# EAGLE design ReleaseRev1 (EAGLE 7.1.0)
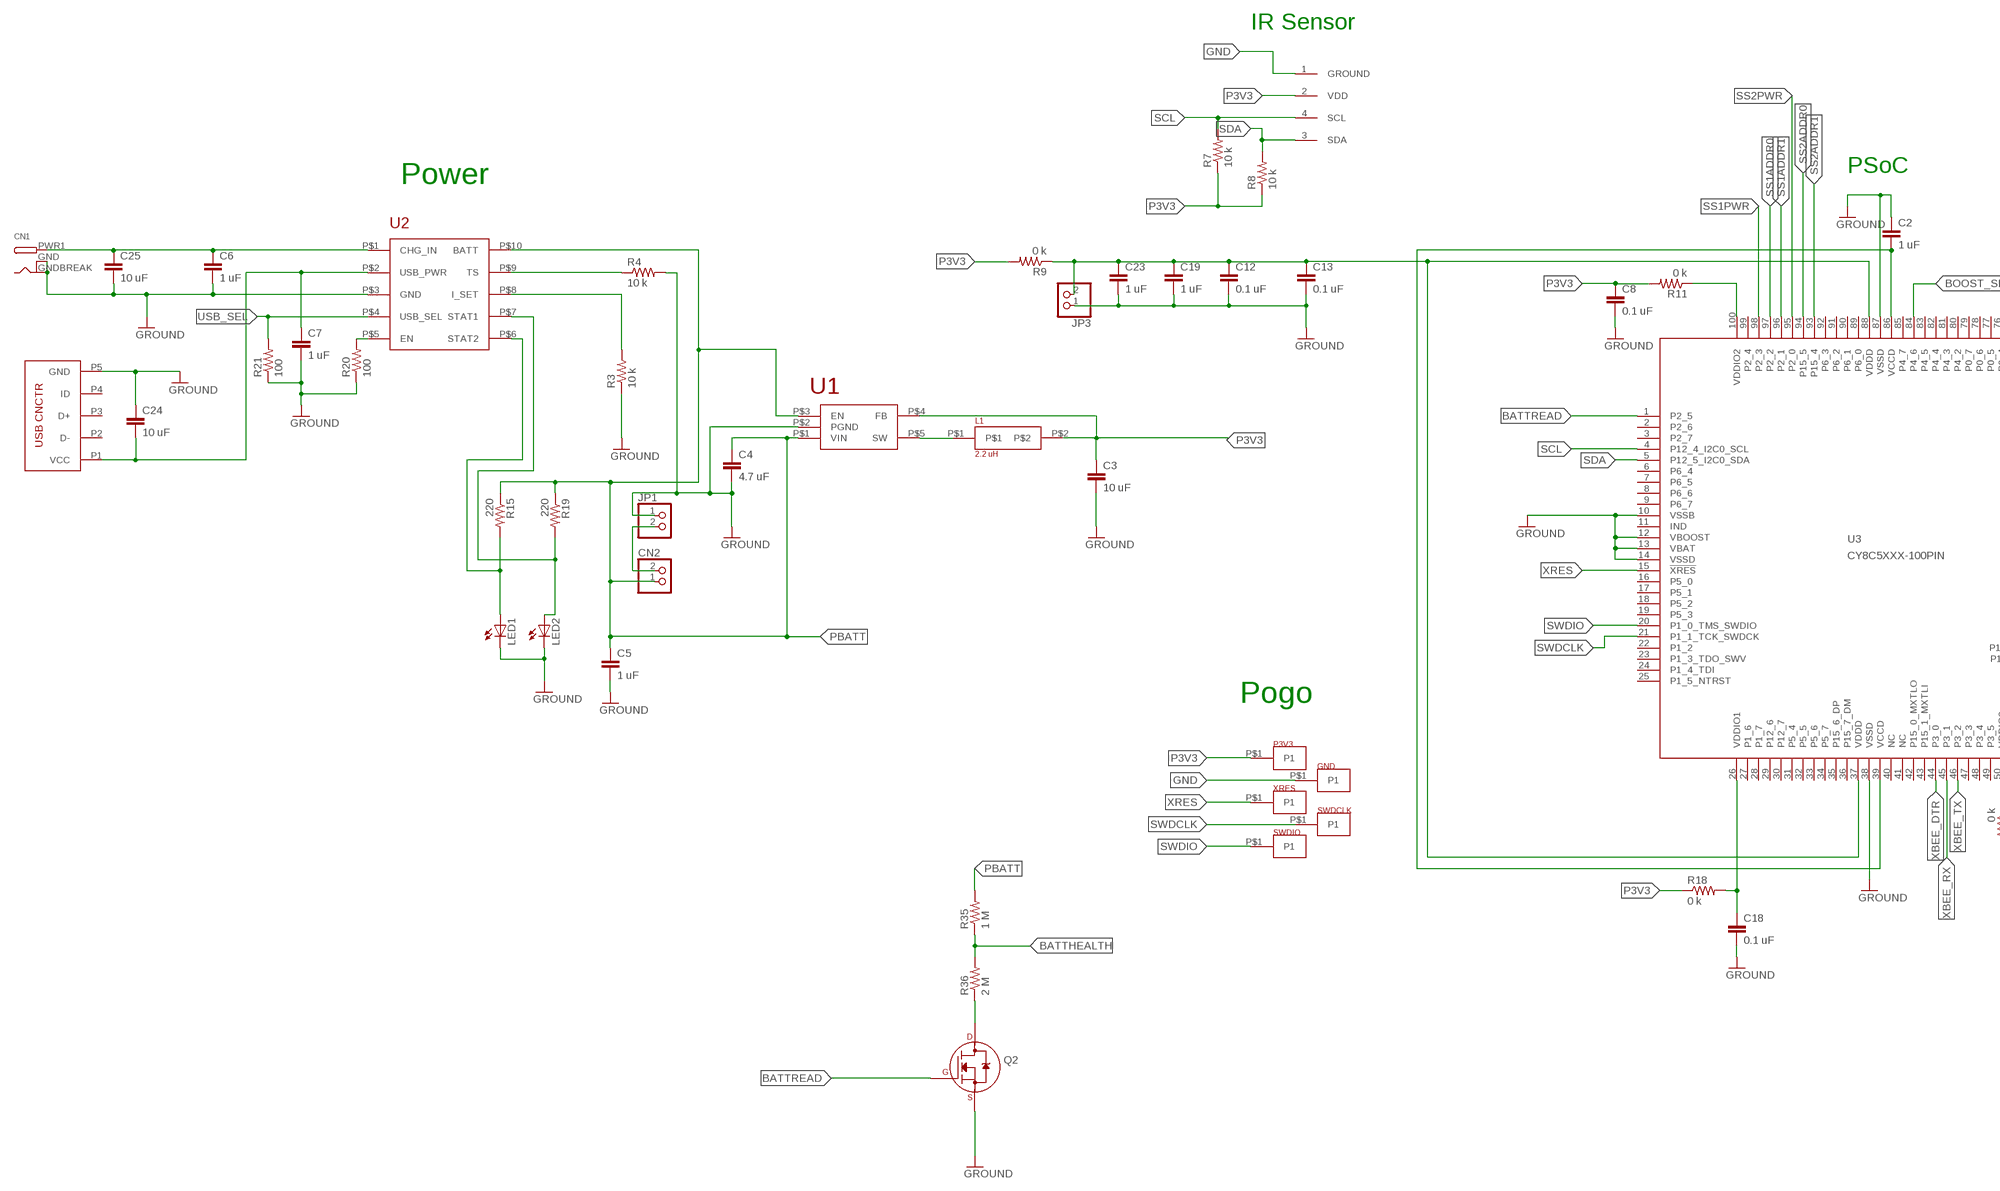
[diagram p0: schematic, sheet 1, part 1 of 2]
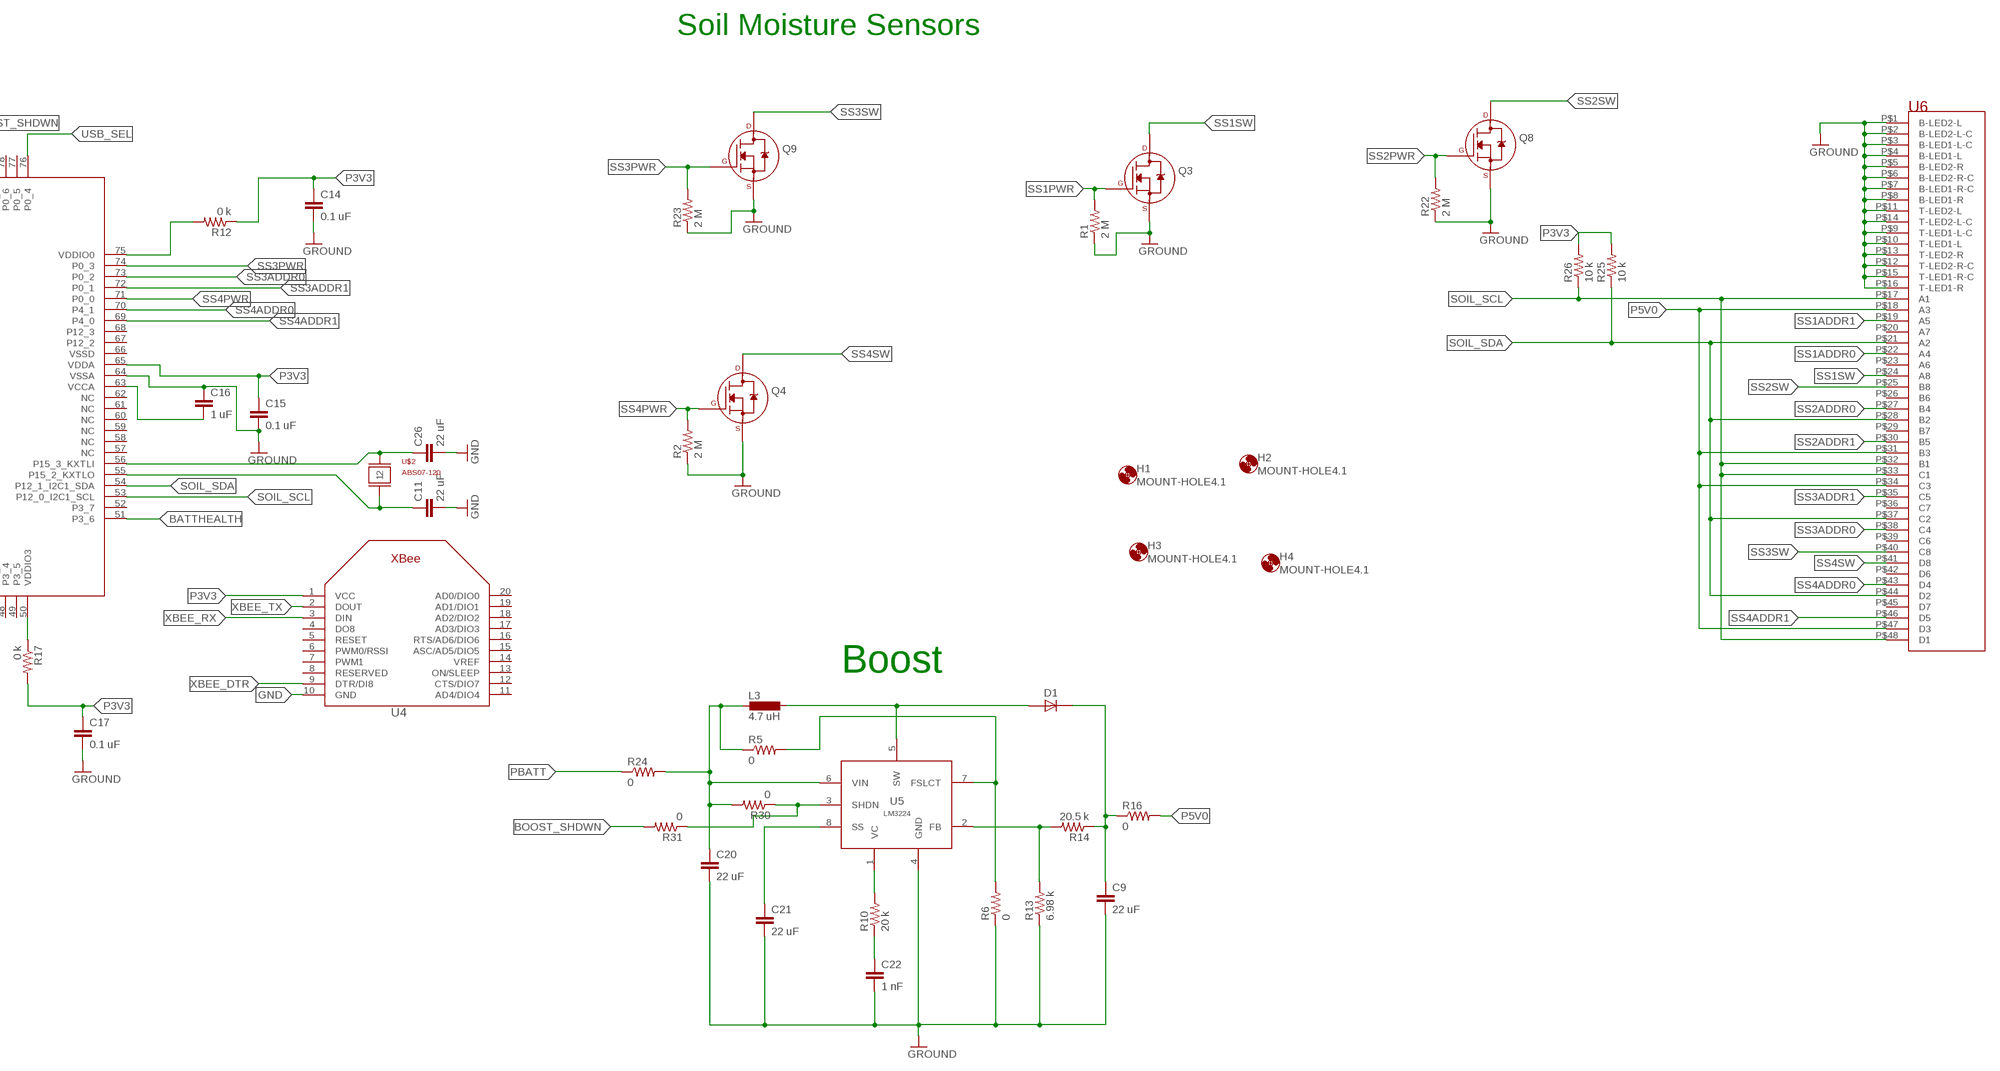
[diagram p1: schematic, sheet 1, part 2 of 2]

## Parts
C2  1 uF  CAPACITOR0603  [0603]
C3  10 uF  CAPACITOR0603  [0603]
C4  4.7 uF  CAPACITOR0603  [0603]
C5  1 uF  CAPACITOR0603  [0603]
C6  1 uF  CAPACITOR0603  [0603]
C7  1 uF  CAPACITOR0603  [0603]
C8  0.1 uF  CAPACITOR0603  [0603]
C9  22 uF  CAPACITOR0603  [0603]
C11  22 uF  CAPACITOR0603  [0603]
C12  0.1 uF  CAPACITOR0603  [0603]
C13  0.1 uF  CAPACITOR0603  [0603]
C14  0.1 uF  CAPACITOR0603  [0603]
C15  0.1 uF  CAPACITOR0603  [0603]
C16  1 uF  CAPACITOR0603  [0603]
C17  0.1 uF  CAPACITOR0603  [0603]
C18  0.1 uF  CAPACITOR0603  [0603]
C19  1 uF  CAPACITOR0603  [0603]
C20  22 uF  CAPACITOR0603  [0603]
C21  22 uF  CAPACITOR0603  [0603]
C22  1 nF  CAPACITOR0603  [0603]
C23  1 uF  CAPACITOR0603  [0603]
C24  10 uF  CAPACITOR0603  [0603]
C25  10 uF  CAPACITOR0603  [0603]
C26  22 uF  CAPACITOR0603  [0603]
CN1  DCBARRELSMT  [DCJACK_2MM_SMT]
CN2  JST_2PIN-SMT-RA  [JST-PH-2-SMT-RA]
D1  DIODE  [0603-LED]
GND  POGO-MOUNTING  [POGO-MOUNTING]
H1  MOUNT-HOLE4.1  [4,1]
H2  MOUNT-HOLE4.1  [4,1]
H3  MOUNT-HOLE4.1  [4,1]
H4  MOUNT-HOLE4.1  [4,1]
IRSENSOR  TO39  [TO39]
JP1  PINHD-1X2  [1X02]
JP3  PINHD-1X2  [1X02]
L1  LPO3310  [LPO3310]
L3  4.7 uH  DO3316P  [DO3316P]
LED1  LEDCHIP-LED0603  [CHIP-LED0603]
LED2  LEDCHIP-LED0603  [CHIP-LED0603]
P3V3  POGO-MOUNTING  [POGO-MOUNTING]
Q2  2N7000_SOT23  [SOT-23]
Q3  2N7000_SOT23  [SOT-23]
Q4  2N7000_SOT23  [SOT-23]
Q8  2N7000_SOT23  [SOT-23]
Q9  2N7000_SOT23  [SOT-23]
R1  2 M  RESISTOR0603  [0603]
R2  2 M  RESISTOR0603  [0603]
R3  10 k  RESISTOR0603  [0603]
R4  10 k  RESISTOR0603  [0603]
R5  0  RESISTOR0603  [0603]
R6  0  RESISTOR0603  [0603]
R7  10 k  RESISTOR0603  [0603]
R8  10 k  RESISTOR0603  [0603]
R9  0 k  RESISTOR0603  [0603]
R10  20 k  RESISTOR0603  [0603]
R11  0 k  RESISTOR0603  [0603]
R12  0 k  RESISTOR0603  [0603]
R13  6.98 k  RESISTOR0603  [0603]
R14  20.5 k  RESISTOR0603  [0603]
R15  220  RESISTOR0603  [0603]
R16  0  R-US_R2010  [R2010]
R17  0 k  RESISTOR0603  [0603]
R18  0 k  RESISTOR0603  [0603]
R19  220  RESISTOR0603  [0603]
R20  100  RESISTOR0603  [0603]
R21  100  RESISTOR0603  [0603]
R22  2 M  RESISTOR0603  [0603]
R23  2 M  RESISTOR0603  [0603]
R24  0  R-US_R2010  [R2010]
R25  10 k  RESISTOR0603  [0603]
R26  10 k  RESISTOR0603  [0603]
R30  0  RESISTOR0603  [0603]
R31  0  RESISTOR0603  [0603]
R35  1 M  RESISTOR0603  [0603]
R36  2 M  RESISTOR0603  [0603]
SWDCLK  POGO-MOUNTING  [POGO-MOUNTING]
SWDIO  POGO-MOUNTING  [POGO-MOUNTING]
U1  LM3671-407564  [LM3671-407564]
U2  LM3658  [LM3658]
U3  CY8C5XXX-100PIN  [TQFP-14X14-100]
U4  XBEE  [XBEE]
U5  LM3224  [MSOP-8]
U6  RJSAE-5380-04  [RJSAE-5380-04]
U$1  FCI10118192-0001LF  [FCI10118192-0001LF]
U$2  ABS07-120  [2-SMD]
XRES  POGO-MOUNTING  [POGO-MOUNTING]

## Nets
BATTHEALTH: R35.1 R36.2 U3.51(P3_6)
BATTREAD: Q2.1(G) U3.1(P2_5)
BOOST_SHDWN: R31.2 U3.84(P4_6)
GND: C2.1 C3.2 C4.2 C5.2 C6.2 C7.2 C8.2 C9.2 C11.2 C12.2 C13.2 C14.2 C15.2 C16.1 C17.2 C18.2 C19.2 C20.2 C21.2 C22.2 C23.2 C24.1 C25.2 C26.2 CN1.GND(GNDBREAK) CN1.GNDBREAK(GND) GND.P$1(P1) IRSENSOR.1(GROUND) JP1.1 JP3.1 LED1.C LED2.C Q2.2(S) Q3.2(S) Q4.2(S) Q8.2(S) Q9.2(S) R1.1 R2.1 R3.1 R4.2 R6.1 R13.1 R20.1 R21.1 R22.1 R23.1 U1.P$2(PGND) U2.P$3(GND) U3.10(VSSB) U3.12(VBOOST) U3.13(VBAT) U3.14(VSSD) U3.38(VSSD) U3.64(VSSA) U3.87(VSSD) U4.10(GND) U5.4(GND) U6.P$1(B-LED2-L) U6.P$2(B-LED2-L-C) U6.P$3(B-LED1-L-C) U6.P$4(B-LED1-L) U6.P$5(B-LED2-R) U6.P$6(B-LED2-R-C) U6.P$7(B-LED1-R-C) U6.P$8(B-LED1-R) U6.P$9(T-LED1-L-C) U6.P$10(T-LED1-L) U6.P$11(T-LED2-L) U6.P$12(T-LED2-R-C) U6.P$13(T-LED2-R) U6.P$14(T-LED2-L-C) U6.P$15(T-LED1-R-C) U6.P$16(T-LED1-R) U$1.P5(GND) ; supply symbol labelled GROUND
N$1: R20.2 U2.P$5(EN)
N$2: R3.2 U2.P$8(I_SET)
N$3: C21.1 U5.8(SS)
N$4: C26.1 U3.56(P15_3_KXTLI) U$2.1
N$5: C6.1 C25.1 CN1.PWR1(PWR) U2.P$1(CHG_IN)
N$6: C18.1 R18.2 U3.26(VDDIO1)
N$7: D1.A L3.2 U5.5(SW)
N$8: R4.1 U2.P$9(TS)
N$9: R10.2 U5.1(VC)
N$10: CN2.2 JP1.2
N$11: C22.1 R10.1
N$12: R13.2 R14.2 U5.2(FB)
N$13: C2.2 U3.39(VCCD) U3.86(VCCD)
N$14: Q2.3(D) R36.1
N$15: C16.2 U3.63(VCCA)
N$16: R5.2 R6.2 U5.7(FSLCT)
N$17: C11.1 U3.55(P15_2_KXTLO) U$2.2
N$18: R12.2 U3.75(VDDIO0)
N$19: R11.1 U3.100(VDDIO2)
N$21: C12.1 C13.1 C19.1 C23.1 JP3.2 R9.1 U3.37(VDDD) U3.88(VDDD)
N$22: R17.1 U3.50(VDDIO3)
N$25: LED2.A R19.2 U2.P$7(STAT1)
N$26: LED1.A R15.2 U2.P$6(STAT2)
N$28: L1.P$1 U1.P$5(SW)
N$47: R30.1 R31.1 U5.3(SHDN)
P: C20.1 L3.1 R5.1 R24.2 R30.2 U5.6(VIN)
P3V3: C3.1 C8.1 C14.1 C15.1 C17.1 IRSENSOR.2(VDD) L1.P$2 P3V3.P$1(P1) R7.1 R8.1 R9.2 R11.2 R12.1 R17.2 R18.1 R25.2 R26.2 U1.P$4(FB) U3.65(VDDA) U4.1(VCC)
P5: C9.1 D1.C R14.1 R16.1
P5V0: R16.2 U6.P$18(A3) U6.P$31(B3) U6.P$34(C3) U6.P$47(D3)
PBATT: C4.1 C5.1 CN2.1 R15.1 R19.1 R24.1 R35.2 U1.P$1(VIN) U1.P$3(EN) U2.P$10(BATT)
SCL: IRSENSOR.4(SCL) R7.2 U3.4(P12_4_I2C0_SCL)
SDA: IRSENSOR.3(SDA) R8.2 U3.5(P12_5_I2C0_SDA)
SOIL_SCL: R26.1 U3.53(P12_0_I2C1_SCL) U6.P$17(A1) U6.P$32(B1) U6.P$33(C1) U6.P$48(D1)
SOIL_SDA: R25.1 U3.54(P12_1_I2C1_SDA) U6.P$21(A2) U6.P$28(B2) U6.P$37(C2) U6.P$44(D2)
SS1ADDR0: U3.97(P2_2) U6.P$22(A4)
SS1ADDR1: U3.96(P2_1) U6.P$19(A5)
SS1PWR: Q3.1(G) R1.2 U3.98(P2_3)
SS1SW: Q3.3(D) U6.P$24(A8)
SS2ADDR0: U3.94(P15_5) U6.P$27(B4)
SS2ADDR1: U3.93(P15_4) U6.P$30(B5)
SS2PWR: Q8.1(G) R22.2 U3.95(P2_0)
SS2SW: Q8.3(D) U6.P$25(B8)
SS3ADDR0: U3.73(P0_2) U6.P$38(C4)
SS3ADDR1: U3.72(P0_1) U6.P$35(C5)
SS3PWR: Q9.1(G) R23.2 U3.74(P0_3)
SS3SW: Q9.3(D) U6.P$40(C8)
SS4ADDR0: U3.70(P4_1) U6.P$43(D4)
SS4ADDR1: U3.69(P4_0) U6.P$46(D5)
SS4PWR: Q4.1(G) R2.2 U3.71(P0_0)
SS4SW: Q4.3(D) U6.P$41(D8)
SWDCLK: SWDCLK.P$1(P1) U3.21(P1_1_TCK_SWDCK)
SWDIO: SWDIO.P$1(P1) U3.20(P1_0_TMS_SWDIO)
USB: C7.1 C24.2 U2.P$2(USB_PWR) U$1.P1(VCC)
USB_SEL: R21.2 U2.P$4(USB_SEL) U3.76(P0_4)
XBEE_DTR: U3.44(P3_0) U4.9(DTR/DI8)
XBEE_RX: U3.45(P3_1) U4.3(DIN)
XBEE_TX: U3.46(P3_2) U4.2(DOUT)
XRES: U3.15(!XRES!) XRES.P$1(P1)
Unconnected: U3.2(P2_6) U3.3(P2_7) U3.6(P6_4) U3.7(P6_5) U3.8(P6_6) U3.9(P6_7) U3.11(IND) U3.16(P5_0) U3.17(P5_1) U3.18(P5_2) U3.19(P5_3) U3.22(P1_2) U3.23(P1_3_TDO_SWV) U3.24(P1_4_TDI) U3.25(P1_5_NTRST) U3.27(P1_6) U3.28(P1_7) U3.29(P12_6) U3.30(P12_7) U3.31(P5_4) U3.32(P5_5) U3.33(P5_6) U3.34(P5_7) U3.35(P15_6_DP) U3.36(P15_7_DM) U3.40(NC) U3.41(NC) U3.42(P15_0_MXTLO) U3.43(P15_1_MXTLI) U3.47(P3_3) U3.48(P3_4) U3.49(P3_5) U3.52(P3_7) U3.57(NC) U3.58(NC) U3.59(NC) U3.60(NC) U3.61(NC) U3.62(NC) U3.66(VSSD) U3.67(P12_2) U3.68(P12_3) U3.77(P0_5) U3.78(P0_6) U3.79(P0_7) U3.80(P4_2) U3.81(P4_3) U3.82(P4_4) U3.83(P4_5) U3.85(P4_7) U3.89(P6_0) U3.90(P6_1) U3.91(P6_2) U3.92(P6_3) U3.99(P2_4) U4.4(DO8) U4.5(RESET) U4.6(PWM0/RSSI) U4.7(PWM1) U4.8(RESERVED) U4.11(AD4/DIO4) U4.12(CTS/DIO7) U4.13(ON/SLEEP) U4.14(VREF) U4.15(ASC/AD5/DIO5) U4.16(RTS/AD6/DIO6) U4.17(AD3/DIO3) U4.18(AD2/DIO2) U4.19(AD1/DIO1) U4.20(AD0/DIO0) U6.P$20(A7) U6.P$23(A6) U6.P$26(B6) U6.P$29(B7) U6.P$36(C7) U6.P$39(C6) U6.P$42(D6) U6.P$45(D7) U$1.P2(D-) U$1.P3(D+) U$1.P4(ID)

## Notes on the sheet
- IR Sensor
- PSoC
- Power
- Soil Moisture Sensors
- Pogo
- Boost

## Library data of the parts
C2-C9 C11-C26 = LAB1_BREAKOUT:CAPACITOR: Generic Capacitor
CN1 = adafruit:DCBARREL: 2.0mm DC Barrel Jack DCJACK_2MM_PTH - Through Hole Jack (4UConnector: 05537)
CN2 = adafruit:JST_2PIN: JST 2-Pin Connectors of various flavors SMT-RA (S2B-PH-SM4) 4UConnector #17311 SMT (B2B-PH-SM4) THM-RA (S2B-PH) THM (B2B-PH)
D1 = Alpha (3):DIODE
GND P3V3 SWDCLK SWDIO XRES = FinalRev:POGO-MOUNTING
H1-H4 = holes:MOUNT-HOLE: MOUNTING HOLE with drill center marker
IRSENSOR = mlx:TO39
JP1 JP3 = pinhead:PINHD-1X2: PIN HEADER
L1 = 136PWR:LPO3310: Coilcraft LPO3310 2.2 uH power inductor 150 mOhms
L3 = inductor-coilcraft:DO3316P: COILCRAFT; OC_FARNELL: unknown; OC_NEWARK: unknown
LED1 LED2 = adafruit:LED: LED OSRAM: - CHIPLED LG R971, LG N971, LY N971, LG Q971, LY Q971, LO R971, LY R971 LH N974, LH R974 LS Q976, LO Q976, LY Q976 LO Q996 - Hyper CHIPLED LW Q18S LB Q993, LB Q99A, LB R99A - SideLED LS A670, LO A670, LY A670, LG A670, LP A670 LB A673, LV A673, LT A673, LW A673 LH A674 LY A675 LS A676, LA A676, LO A676, LY A676, LW A676 LS A679, LY A679, LG A679 - Hyper Micro SIDELED® LS Y876, LA Y876, LO Y876, LY Y876 LT Y87S - SmartLED LW L88C, LW L88S LB L89C, LB L89S, LG L890 LS L89K, LO L89K, LY L89K LS L896, LA L896, LO L896, LY L896 - TOPLED LS T670, LO T670, LY T670, LG T670, LP T670 LSG T670, LSP T670, LSY T670, LOP T670, LYG T670 LG T671, LOG T671, LSG T671 LB T673, LV T673, LT T673, LW T673 LH T674 LS T676, LA T676, LO T676, LY T676, LB T676, LH T676, LSB T676, LW T676 LB T67C, LV T67C, LT T67C, LS T67K, LO T67K, LY T67K, LW E67C LS E67B, LA E67B, LO E67B, LY E67B, LB E67C, LV E67C, LT E67C LW T67C LS T679, LY T679, LG T679 LS T770, LO T770, LY T770, LG T770, LP T770 LB T773, LV T773, LT T773, LW T773 LH T774 LS E675, LA E675, LY E675, LS T675 LS T776, LA T776, LO T776, LY T776, LB T776 LHGB T686 LT T68C, LB T68C - Hyper Mini TOPLED® LB M676 - Mini TOPLED Santana® LG M470 LS M47K, LO M47K, LY M47K Source: http://www.osram.convergy.de/
Q2-Q4 Q8 Q9 = transistors:2N700*: 2N7000, 2N7002, NDS7002A N-channel enhancement mode MOSFET
R1-R15 R17-R23 R25 R26 R30 R31 R35 R36 = LAB1_BREAKOUT:RESISTOR: Generic Resistor
R16 R24 = adafruit:R-US_: RESISTOR, American symbol
U1 = 136PWR:LM3671-407564: DC DC voltage regulator
U2 = LM3658:LM3658
U3 = cypress_psoc_V2_0:CY8C5XXX-100PIN: Cypress PSoC® 5 - Programmable System on Chip, ARM Cortex-M3 Based Source Data: http://www.cypress.com/?mpn=CY8C5588AXI-060 LBR Source: http://www.westmarkelectronics.com Thomas W. Moxon Director of Engineering www.westmarkelectronics.com; MPN: CY8C5588AXI-060
U4 = Alpha (3):XBEE
U5 = Alpha (3):LM3224
U6 = FinalRev:RJSAE-5380-04
U$1 = USB_Connectors_5P_Micro_USB:FCI10118192-0001LF
U$2 = ABS07-120:ABS07-120

## Board
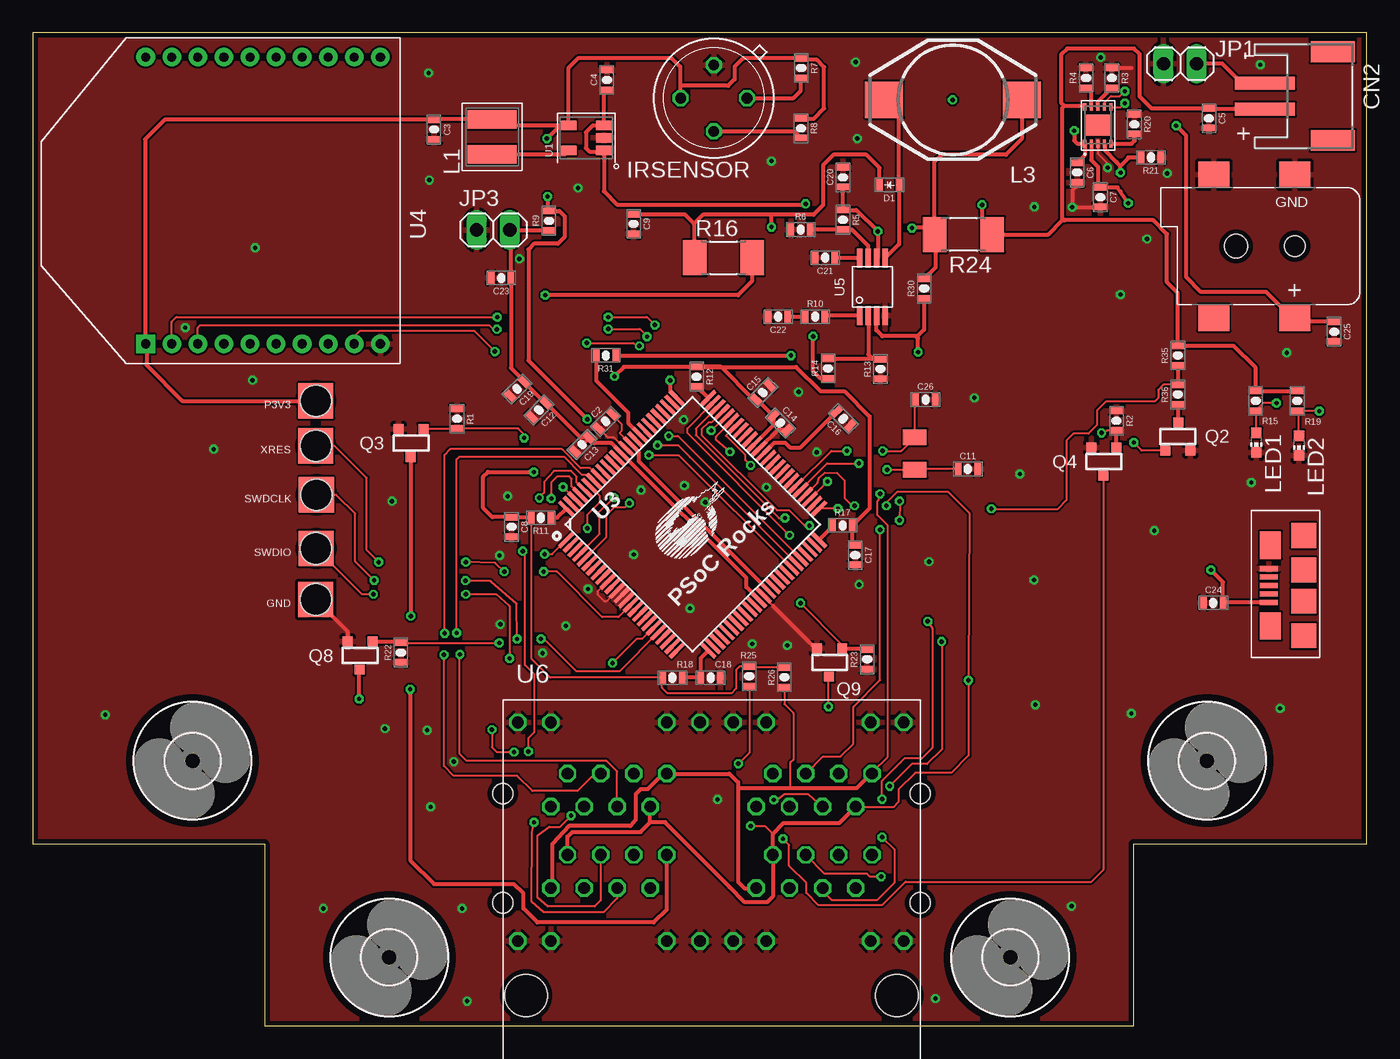
[diagram p2: board, top side]
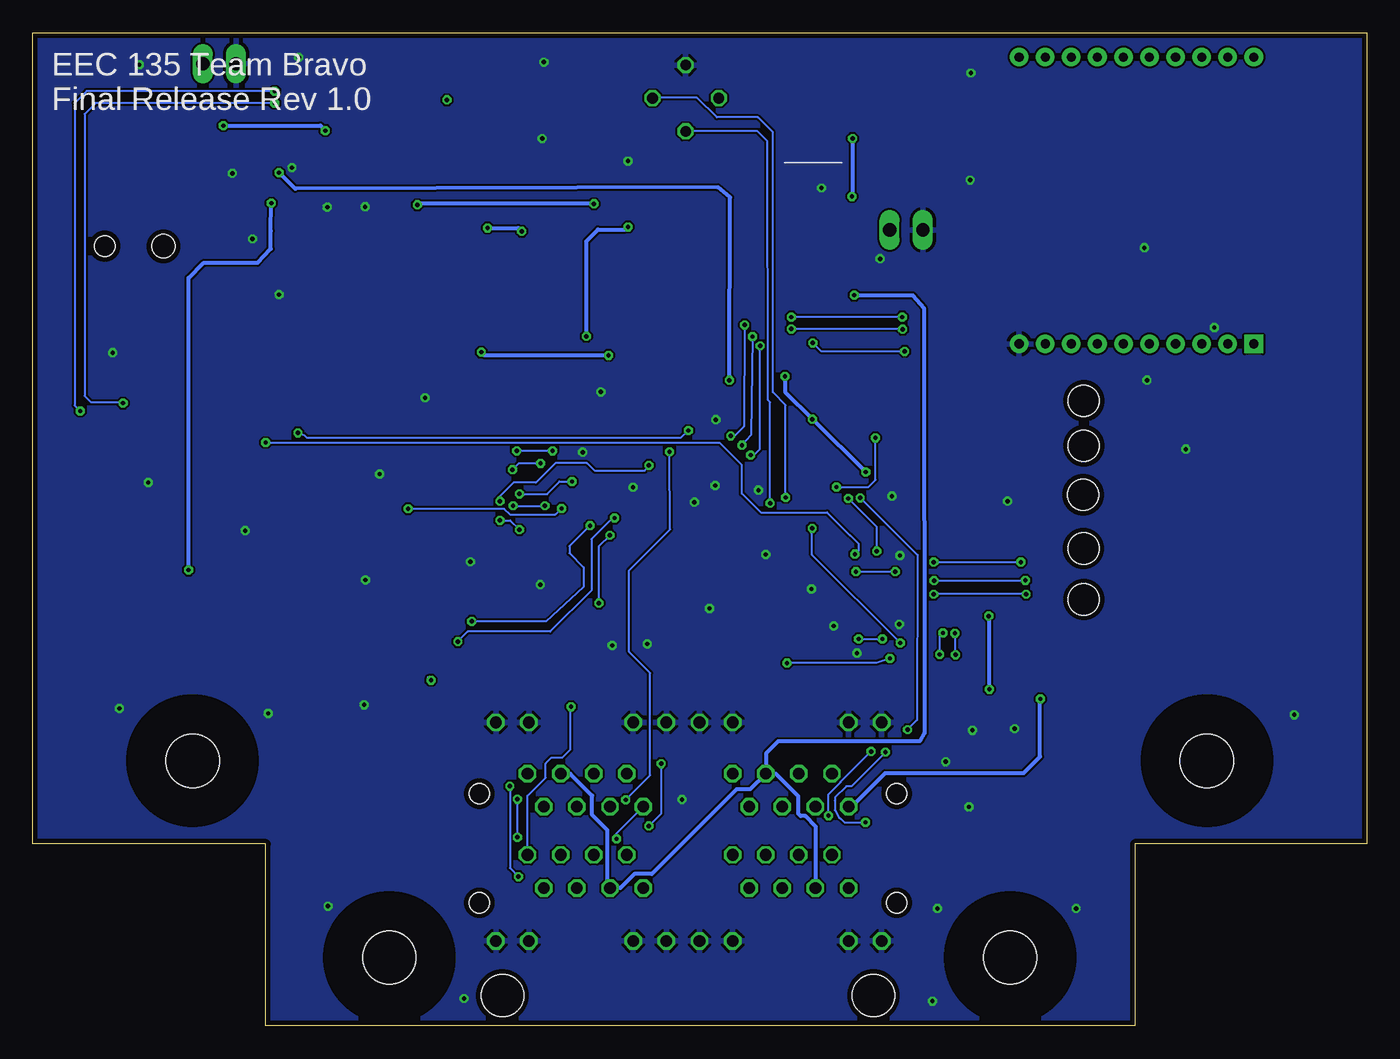
[diagram p3: board, bottom side, seen from below]

Size 102.34 x 76.2 mm. Coordinates in mm from the lower left corner, seen from the top.
Outline: 17.78,0 84.45,0 84.45,13.97 102.34,13.97 102.34,76.2 0,76.2 0,13.97 17.78,13.97 17.78,0
Copper layers (1*16): Top 0.0356mm / dielectric 1.5011mm / Bottom 0.0356mm
Design rules "LaenPCBOrder": minimum track width 6mil, minimum drill 13mil, track to track 6mil, track to pad 6mil, pad to pad 6mil, via to via 6mil, smd to smd 6mil, copper to edge 15mil, drill to drill 6mil, minimum pad ring 7mil, minimum via ring 7mil, stop-mask expansion 3mil, vias tented up to drill 0mil, thermal gap 10mil

### Footprints (pad centres in the part's own frame; a part is rotated, then mirrored left to right if it is on the bottom)
0603 = smd 0.5 x 0.9: 1 -0.75,0; 2 0.75,0
DCJACK_2MM_SMT = smd 2.4 x 2: GND 0,-5.5; GNDBREAK 6.2,-5.5; PWR1 0,5.5; PWR2 6.2,5.5 | hole 1.6: 0,0 | hole 1.8: 4.5,0
JST-PH-2-SMT-RA = smd 1 x 4.6: 1 1,-3.7; 2 -1,-3.7 | smd 1.6 x 3.4: NC1 -3.4,1.5; NC2 3.4,1.5
0603-LED = smd 0.5 x 0.9: A -0.75,0; C 0.75,0
POGO-MOUNTING = smd 2.7 x 2.7: P$1 0,0 | hole 2.4: 0,0
4,1 = hole 4.1: 0,0
TO39 = drill 0.813 octagon: 1 0,-2.54; 2 2.54,0; 3 0,2.54; 4 -2.54,0
1X02 = drill 1.016 long: 1 -1.27,0; 2 1.27,0
LPO3310 = smd 1.42 x 3.76: P$1 -1.34,0; P$2 1.34,0
DO3316P = smd 2.92 x 2.79: 1 -5.28,0; 2 5.28,0
CHIP-LED0603 = smd 0.8 x 0.8: A 0,-0.75; C 0,0.75
SOT-23 = smd 0.762 x 0.762: 1 -0.979,-1.101; 2 0.94,-1.101; 3 0.025,1.067
R2010 = smd 1.8 x 2.7: 1 -2.2,0; 2 2.2,0
LM3671-407564 = smd 0.74 x 1.19: P$1 -0.95,-1.35; P$2 0,-1.35; P$3 0.95,-1.35; P$4 0.95,1.35; P$5 -0.95,1.35
LM3658 = smd 0.6 x 0.25: P$1 0,0; P$2 0,-0.5; P$3 0,-1; P$4 0,-1.5; P$5 0,-2; P$6 2.8,-2; P$7 2.8,-1.5; P$8 2.8,-1; P$9 2.8,-0.5; P$10 2.8,0 | smd 1.6 x 2: P$11 1.4,-1
TQFP-14X14-100 = smd 1.5 x 0.3: 1 -7.7,6; 2 -7.7,5.5; 3 -7.7,5; 4 -7.7,4.5; 5 -7.7,4; 6 -7.7,3.5; 7 -7.7,3; 8 -7.7,2.5; 9 -7.7,2; 10 -7.7,1.5; 11 -7.7,1; 12 -7.7,0.5; 13 -7.7,0; 14 -7.7,-0.5; 15 -7.7,-1; 16 -7.7,-1.5; 17 -7.7,-2; 18 -7.7,-2.5; 19 -7.7,-3; 20 -7.7,-3.5; 21 -7.7,-4; 22 -7.7,-4.5; 23 -7.7,-5; 24 -7.7,-5.5; 25 -7.7,-6; 51 7.7,-6; 52 7.7,-5.5; 53 7.7,-5; 54 7.7,-4.5; 55 7.7,-4; 56 7.7,-3.5; 57 7.7,-3; 58 7.7,-2.5; 59 7.7,-2; 60 7.7,-1.5; 61 7.7,-1; 62 7.7,-0.5; 63 7.7,0; 64 7.7,0.5; 65 7.7,1; 66 7.7,1.5; 67 7.7,2; 68 7.7,2.5; 69 7.7,3; 70 7.7,3.5; 71 7.7,4; 72 7.7,4.5; 73 7.7,5; 74 7.7,5.5; 75 7.7,6 | smd 0.3 x 1.5: 26 -6,-7.7; 27 -5.5,-7.7; 28 -5,-7.7; 29 -4.5,-7.7; 30 -4,-7.7; 31 -3.5,-7.7; 32 -3,-7.7; 33 -2.5,-7.7; 34 -2,-7.7; 35 -1.5,-7.7; 36 -1,-7.7; 37 -0.5,-7.7; 38 0,-7.7; 39 0.5,-7.7; 40 1,-7.7; 41 1.5,-7.7; 42 2,-7.7; 43 2.5,-7.7; 44 3,-7.7; 45 3.5,-7.7; 46 4,-7.7; 47 4.5,-7.7; 48 5,-7.7; 49 5.5,-7.7; 50 6,-7.7; 76 6,7.7; 77 5.5,7.7; 78 5,7.7; 79 4.5,7.7; 80 4,7.7; 81 3.5,7.7; 82 3,7.7; 83 2.5,7.7; 84 2,7.7; 85 1.5,7.7; 86 1,7.7; 87 0.5,7.7; 88 0,7.7; 89 -0.5,7.7; 90 -1,7.7; 91 -1.5,7.7; 92 -2,7.7; 93 -2.5,7.7; 94 -3,7.7; 95 -3.5,7.7; 96 -4,7.7; 97 -4.5,7.7; 98 -5,7.7; 99 -5.5,7.7; 100 -6,7.7
XBEE = drill 0.7 pad 1.422 square: 1 -11,5.5 | drill 0.7 pad 1.422: 2 -11,3.5; 3 -11,1.5; 4 -11,-0.5; 5 -11,-2.5; 6 -11,-4.5; 7 -11,-6.5; 8 -11,-8.5; 9 -11,-10.5; 10 -11,-12.5; 11 11,-12.5; 12 11,-10.5; 13 11,-8.5; 14 11,-6.5; 15 11,-4.5; 16 11,-2.5; 17 11,-0.5; 18 11,1.5; 19 11,3.5; 20 11,5.5
MSOP-8 = smd 1.45 x 0.45: 1 -2.2,0.975; 2 -2.2,0.325; 3 -2.2,-0.325; 4 -2.2,-0.975; 5 2.2,-0.975; 6 2.2,-0.325; 7 2.2,0.325; 8 2.2,0.975
RJSAE-5380-04 = drill 0.89 octagon: P$1 1.15,4.19; P$2 3.69,4.19; P$3 12.58,4.19; P$4 15.12,4.19; P$5 17.66,4.19; P$6 20.2,4.19; P$7 28.2,4.19; P$8 30.74,4.19; P$9 1.15,20.95; P$10 3.69,20.95; P$11 12.58,20.95; P$12 15.12,20.95; P$13 17.66,20.95; P$14 20.2,20.95; P$15 28.2,20.95; P$16 30.74,20.95; P$17 3.69,8.25; P$18 6.23,8.25; P$19 8.77,8.25; P$20 11.31,8.25; P$21 4.96,10.79; P$22 7.5,10.79; P$23 10.04,10.79; P$24 12.58,10.79; P$25 3.69,14.48; P$26 6.23,14.48; P$27 8.77,14.48; P$28 11.31,14.48; P$29 4.96,17.02; P$30 7.5,17.02; P$31 10.04,17.02; P$32 12.58,17.02; P$33 19.44,8.25; P$34 21.98,8.25; P$35 24.52,8.25; P$36 27.06,8.25; P$37 20.71,10.79; P$38 23.23,10.79; P$39 25.77,10.79; P$40 28.31,10.79; P$41 19.44,14.48; P$42 21.98,14.48; P$43 24.52,14.48; P$44 27.06,14.48; P$45 20.71,17.02; P$46 23.23,17.02; P$47 25.77,17.02; P$48 28.31,17.02 | hole 3.25: 1.78,0; 30.23,0 | hole 1.57: 0,7.11; 0,15.49; 32,7.11; 32,15.49
FCI10118192-0001LF = smd 0.4 x 1.35: P1 -1.3,2.675; P2 -0.65,2.675; P3 0,2.675; P4 0.65,2.675; P5 1.3,2.675 | smd 1.9 x 1.9: P$1 -1.2,0; P$2 1.2,0; P$3 3.85,0; P$4 -3.85,0 | smd 2.1 x 1.6: P$5 -3.1,2.55; P$6 3.1,2.55
2-SMD = smd 1.2 x 1.8: 1 -1.25,0; 2 1.25,0

### Placement (x,y rotation side)
C2  43.94,46.38 45 top
C3  30.78,68.76 270 top
C4  44.04,72.57 90 top
C5  90.22,69.62 270 top
C6  80.11,65.46 270 top
C7  81.89,63.58 270 top
C8  36.73,38.28 270 top
C9  46.1,61.52 270 top
C11  71.73,42.72 0 top
C12  38.84,47.24 225 top
C13  42.14,44.6 225 top
C14  57.35,46.25 315 top
C15  56.01,48.59 45 top
C16  62.18,46.58 135 top
C17  63.09,36.12 270 top
C18  51.99,26.72 0 top
C19  37.16,48.87 225 top
C20  62.15,65.1 90 top
C21  60.78,58.93 180 top
C22  57.18,54.41 180 top
C23  35.94,57.38 180 top
C24  90.55,32.46 0 top
C25  99.82,53.26 270 top
C26  68.48,48.06 0 top
CN1  96.8,59.82 180 top
CN2  98.22,71.32 270 top
D1  65.71,64.52 180 top
GND  21.72,32.72 180 top
H1  74.98,5.26 0 top
H2  27.36,5.26 0 top
H3  90.07,20.35 0 top
H4  12.27,20.35 0 top
IRSENSOR  52.25,71.17 180 top
JP1  88.01,73.81 0 top
JP3  35.33,61.06 0 top
L1  35.26,68.2 90 top
L3  70.59,71.04 180 top
LED1  93.85,44.75 180 top
LED2  97.13,44.53 180 top
P3V3  21.72,47.96 180 top
Q2  87.86,45.24 0 top
Q3  29.01,44.7 180 top
Q4  82.14,43.28 180 top
Q8  25.1,28.4 180 top
Q9  61.11,27.86 180 top
R1  32.56,46.58 270 top
R2  83.13,46.43 270 top
R3  82.78,72.72 270 top
R4  80.8,72.72 90 top
R5  62.15,61.85 270 top
R6  58.9,61.09 0 top
R7  58.95,73.48 270 top
R8  58.93,68.86 270 top
R9  39.6,61.77 90 top
R10  60.02,54.41 0 top
R11  38.99,38.99 180 top
R12  50.93,49.81 270 top
R13  65.02,50.39 90 top
R14  61.01,50.44 90 top
R15  93.8,47.96 270 top
R16  52.98,58.93 0 top
R17  62.13,38.4 0 top
R18  49.07,26.72 0 top
R19  97,47.96 270 top
R20  84.51,69.16 270 top
R21  85.78,66.62 180 top
R22  28.24,28.65 90 top
R23  64.01,28.12 90 top
R24  71.4,60.71 180 top
R25  54.97,26.82 90 top
R26  57.66,26.75 90 top
R30  68.38,56.57 90 top
R31  43.97,51.44 180 top
R35  87.83,51.44 90 top
R36  87.83,48.44 90 top
SWDCLK  21.77,40.74 180 top
SWDIO  21.74,36.63 180 top
U1  42.47,68.12 90 top
U2  80.7,67.69 90 top
U3  50.62,38.48 45 top
U4  14.17,63.32 90 top
U5  64.41,56.69 90 top
U6  36.07,2.34 0 top
U$1  97.49,33.78 90 top
U$2  67.67,43.92 270 top
XRES  21.72,44.5 180 top

### Tracks (layer width: path | path; a pad name or v marks a point on that pad's centre or on a via)
BATTHEALTH  (via drill 0.33)
  Top 0.152: R36.2 86.73,49.19 86.33,48.79 86.33,48.18 86.06,47.9 82.32,47.9 81.64,47.22 81.64,46.1 80.97,45.44 79.83,45.44 79.3,44.91 79.3,40.34 78.64,39.67 v73.53,39.67 | v61.77,39.7 60.33,39.7 U3.51
  Top 0.305: R35.1 R36.2
  Bottom 0.152: v61.77,39.7 62.23,39.24 65.73,39.24 66.17,39.67 v73.53,39.67
BATTREAD  (via drill 0.33)
  Top 0.152: Q2.1 85.07,44.14 v84.45,44.76 | v39.27,36.2 39.85,36.2 U3.1
  Bottom 0.152: v84.45,44.76 49.66,44.76 47.93,43.03 47.93,40.84 46.48,39.4 41.4,39.4 39.65,37.64 39.62,37.64 38.99,37.01 38.99,36.47 v39.27,36.2
BOOST_SHDWN
  Top 0.305: R31.2 43.22,49.49 45.67,47.04 45.67,46.26 U3.84
GND  (via drill 0.33)
  Top 0.152: U3.10 44.08,34.1 43.33,33.35 43.33,33.1 43.81,32.61 44.05,32.61 U3.12 | U3.87 45.46,44.28 44.6,45.14 44.12,45.14 44.02,45.24 C2.1 | U3.38 56.07,32.96 56.79,32.23 | U2.P$3 81.7,66.92 82.45,66.17 v82.45,65.84
  Top 0.305: 84.28,73.48 82.79,73.48 R3.1 | C6.2 80.11,64.47 79.76,64.11 79.76,62.84 v79.73,62.81 81.88,62.81 C7.2 | C14.2 57.16,45.72 U3.64 | Q9.2 60.06,28.96 56.79,32.23 | GND.P$1 24.16,30.28 Q8.2
  other vias: 63.12,73.94 30.38,73.1 30.43,64.9 17.07,59.69 5.56,23.88 22.3,9.02 32.94,9.02 33.32,1.91 69.24,2.11 79.68,9.19 84.28,23.98 95.68,24.36 87.02,65.41 94.16,73.74 56.67,66.34 76.83,62.84 58.75,48.64 40.89,30.68 35.86,30.81 81.92,74.3 35.81,36.09 42.6,33.53 49.94,46.51 51.59,40.18 56.29,41.33 60.15,44.02 46.1,36.17 50.42,32.03 49.99,41.45 46.66,41.1 55.19,29.31 57.89,29.18 63.4,33.86 68.76,35.61 76.81,34.21 72.24,48.18 75.72,42.34 83.44,56.11 85.47,60.38 52.53,17.37 32.31,20.27 36.42,40.64 37.34,58.85 41.83,64.29 76.91,24.64 86.03,38 93.47,41.68 96.19,51.64 13.89,44.25 16.87,49.53 27.56,40.26 30.53,16.81 30.25,22.68 27.03,22.81 39.12,28.6 11.71,53.57 63.25,68.07
  pour Bottom: -5.89,81.84 111.07,81.84 111.07,65.63 110.69,65.63 110.69,-8.31 -5.89,-8.31
  pour Top: -7.98,83.95 114.4,83.95 114.4,-10.87 -7.98,-10.87
N$1
  Top 0.305: U2.P$5 84.3,67.69 84.51,67.89 R20.2
N$2
  Top 0.305: U2.P$8 81.7,70.89 R3.2
N$3
  Top 0.305: U5.8 61.57,58.89 C21.1
N$4  (via drill 0.33)
  Top 0.152: U3.56 58.6,41.45 61.27,44.12 v62.46,44.12 | v65.2,44.12 66.62,44.12 U$2.1 67.67,47.99 C26.1
  Bottom 0.152: v62.46,44.12 v65.2,44.12
N$5  (via drill 0.33)
  Top 0.305: C25.1 97.1,54.01 CN1.PWR1 96.61,54.32 94.61,56.31 89.61,56.31 88.47,57.45 88.47,68.3 v87.71,69.06 | C6.1 80.7,66.79 U2.P$1 80.11,67.69 79.88,67.92 v79.88,68.68
  Bottom 0.305: v87.71,69.06 80.26,69.06 v79.88,68.68
N$6
  Top 0.305: 49.84,26.73 R18.2 C18.1 51.24,28.21 U3.26
N$7
  Top 0.305: 64.01,71.04 L3.2 66.46,69.89 D1.A 66.46,59.96 U5.5
N$8
  Top 0.305: U2.P$9 81.2,71.57 R4.1
N$9
  Top 0.305: U5.1 60.86,54.49 R10.2
N$10
  Top 0.305: CN2.2 92.73,72.32 91.24,73.81 JP1.2
N$11
  Top 0.305: C22.1 R10.1
N$12
  Top 0.305: R14.2 64.41,51.19 | 64.41,51.19 64.97,51.19 R13.2 | U5.2 64.09,51.52 64.41,51.19
N$13
  Top 0.152: C2.2 44.47,46.87 45.16,46.18 45.16,45.62 45.03,45.49 45.03,45.48 U3.86
  Top 0.305: U3.86 46.48,44.03 46.48,43.33 U3.39
N$14
  Top 0.305: R36.1 87.83,46.35 Q2.3
N$15
  Top 0.152: U3.63 56.09,43.93
  Top 0.305: 56.09,43.93 56.09,43.95 56.9,44.76 57.71,44.76 58.09,44.37 58.91,44.37 C16.2
N$16
  Top 0.305: R6.2 59.66,61.1 R5.2 62.83,61.1 64.08,59.84 U5.7
N$17  (via drill 0.33)
  Top 0.152: U3.55 58.9,41.12 60.94,43.16 v63.37,43.16 | v65.53,42.67 U$2.2 67.72,42.72 C11.1
  Bottom 0.152: v63.37,43.16 65.05,43.16 v65.53,42.67
N$18
  Top 0.305: R12.2 U3.75
N$19
  Top 0.305: R11.1 40.24,38.99 U3.100
N$21
  Top 0.305: R9.1 36.65,61.01 | 36.65,61.01 JP3.2 | C13.1 42.44,44.85 | 36.65,61.01 36.65,57.42 C23.1 36.69,50.48 37.69,49.48 C19.1 39.32,47.77 C12.1 42.01,45.13 C13.1 | U3.88 | U3.88 44.4,44.7 43.1,44.7 C13.1 | U3.37 54.74,33.66 54.74,34.37 U3.88 | U3.88
N$22
  Top 0.152: R17.1 61.38,38.35
  Top 0.305: 61.38,38.35 U3.50
N$25  (via drill 0.33)
  Top 0.152: LED2.A 97.13,47 R19.2 97.04,47.17 v98.68,47.17 | U2.P$7 82.2,70.82 82.7,71.32 83.39,71.32 v83.77,71.7
  Bottom 0.152: v83.77,71.7 98.2,71.7 99.11,70.79 99.11,47.6 v98.68,47.17
N$26  (via drill 0.33)
  Top 0.152: LED1.A 93.85,47.15 R15.2 94.37,47.78 v95.4,47.78 | U2.P$6 83.47,70.49 v83.77,70.79
  Bottom 0.152: v83.77,70.79 97.51,70.79 98.35,69.95 98.35,48.34 97.87,47.85 95.48,47.85 v95.4,47.78
N$28
  Top 0.305: L1.P$1 40.8,66.86 U1.P$5
N$30  (via drill 0.33)
  other vias: 70.56,71.04
N$47  (via drill 0.33)
  Top 0.305: R30.1 68.38,53.42 67.87,52.91 67.74,52.91 | 67.74,52.91 65.18,52.91 64.72,53.37 64.72,54.47 U5.3 | R31.1 v58.17,51.44 | v67.92,51.69 67.92,52.73 67.74,52.91
  Bottom 0.305: v58.17,51.44 67.67,51.44 v67.92,51.69
P  (via drill 0.33)
  Top 0.305: L3.1 75.87,68.04 74.65,66.83 69.72,66.83 69.14,66.24 69.14,61.22 | 69.14,61.22 R24.2 69.25,58.19 R30.2 | 69.14,61.22 67.45,61.22 v67.44,61.21 | U5.6 64.82,58.97 v64.82,60.96 63.18,62.6 R5.1 C20.1
  Bottom 0.305: v67.44,61.21 65.08,61.21 v64.82,60.96
P3V3  (via drill 0.33)
  Top 0.152: 62.88,37.08 C17.1 | C15.1 55.55,48.06 | R11.2 38.25,38.98 38.25,28.17 39.7,26.72 R18.1 48.28,26.68 48.28,25.93 48.69,25.53 53.59,25.53 53.95,25.88 53.95,27.3 54.22,27.57 R25.2 55.04,27.5 R26.2
  Top 0.305: 8.74,52.39 U4.1 8.64,52.36 8.64,68.02 10.12,69.51 C3.1 30.82,69.54 L1.P$2 35.72,69.07 U1.P$4 | U1.P$4 41.12,73.5 41.88,74.27 48.97,74.27 49.66,73.58 49.66,72.19 | 49.66,72.19 49.66,71.22 IRSENSOR.2 | R8.1 59.93,69.61 60.71,70.38 60.71,73.56 60.15,74.12 59.07,74.12 R7.1 54.5,74.23 53.85,73.58 53.85,72.62 53.34,72.11 49.73,72.11 49.66,72.19 | U1.P$4 40.45,69.07 v39.45,68.07 | v39.5,63.63 39.5,62.62 R9.2 40.4,62.52 40.82,62.1 40.82,60.53 40.28,59.99 38.46,59.99 38.02,59.56 38.02,51.05 v42.53,46.55 | 62.88,37.08 R17.2 64.19,39.71 64.19,46.76 62.26,48.69 60.43,48.69 58.56,50.56 R12.1 | C15.1 55.29,48.06 52.78,50.57 R12.1 | 55.55,48.06 C14.1 56.82,46.1 U3.65 | R12.1 45.35,50.56 v44.63,49.84 | 38.25,39.01 38.25,39 R11.2 36.77,38.99 C8.1 35.24,39.03 34.57,39.73 34.57,42.14 34.92,42.49 v38.43,42.49 | 8.76,52.41 8.74,52.39 | 8.74,52.39 8.74,50.7 11.48,47.95 P3V3.P$1
  Bottom 0.305: v39.45,68.07 39.45,63.68 v39.5,63.63 | v44.63,49.84 44.63,48.64 v42.53,46.55 42.49,46.51 v38.43,42.49
P5  (via drill 0.33)
  Top 0.305: D1.C 64.96,65.83 63.96,66.83 61.42,66.83 60.63,66.04 60.63,62.97 59.89,62.23 56.67,62.23 | 56.67,62.23 51.41,62.23 50.72,61.54 | 50.72,61.54 50.72,58.99 R16.1 | C9.1 50,62.27 50.72,61.54 | R14.1 60.39,49.69 59.84,50.24 59.84,52.88 v59.87,52.91 | v56.67,61.29 56.67,62.23
  Bottom 0.305: v59.87,52.91 59.87,60.2 58.98,61.09 56.87,61.09 v56.67,61.29
P5V0  (via drill 0.33)
  Top 0.305: R16.2 55.18,57.14 54.1,56.06 v39.32,56.06
  Bottom 0.305: U6.P$18 42.27,10.62 42.27,15.29 43.08,16.1 43.43,16.1 43.61,16.28 43.61,17.63 45.34,19.36 U6.P$31 | U6.P$31 47.3,18.16 48.34,18.16 54.84,11.66 56.19,11.66 57.26,10.59 U6.P$34 58.24,10.78 58.24,15.01 59.41,16.18 59.41,17.65 61.11,19.36 U6.P$47 | v39.32,56.06 34.85,56.06 33.98,55.07 33.93,22.45 34.29,21.84 45.16,21.84 46.08,20.9 U6.P$31
PBATT  (via drill 0.33)
  Top 0.305: CN2.1 90.27,70.32 C5.1 85.84,70.37 84.91,71.3 84.91,74.55 84.48,74.98 79.35,74.98 78.87,74.5 78.87,70.84 79.12,70.59 | 79.12,70.59 80.6,70.59 U2.P$10 | 78.99,61.95 78.99,61.8 77.9,60.71 R24.1 72.82,61.94 v72.82,62.99 | 78.99,61.95 78.99,70.46 79.12,70.59 | C4.1 43.82,71.59 U1.P$3 42.96,69.07 42.44,68.56 42.44,67.33 42.7,67.08 43.73,67.08 U1.P$1 43.82,64.03 44.83,63.02 59.23,63.02 v59.28,63.07 | R19.1 R15.1 93.8,50.49 92.13,52.17 87.85,52.17 R35.2 87.83,56.24 87,57.07 87,60.76 85.95,61.8 79.15,61.8 78.99,61.95
  Bottom 0.305: v59.28,63.07 72.75,63.07 v72.82,62.99
SCL  (via drill 0.33)
  Top 0.152: U3.4 42.01,36.25 42.01,36.27 43.48,37.74 43.48,38.99 43.38,39.09 43.38,39.34 v44.58,40.54
  Top 0.305: IRSENSOR.4 58.34,71.17 58.93,71.75 58.93,72.71 R7.2
  Bottom 0.152: v44.58,40.54 44.58,47.62 45.57,48.62 45.57,68.56 46.71,69.7 49.86,69.7 51.38,71.22 54.74,71.22 IRSENSOR.4
SDA  (via drill 0.33)
  Top 0.152: U3.5 42.37,35.87 44.02,37.52 44.02,39.14 43.99,39.17 44.63,39.8 45.47,39.8 v45.77,40.11
  Top 0.305: IRSENSOR.3 58.41,68.63 R8.2
  Bottom 0.152: v45.77,40.11 45.77,47.85 45.95,48.03 45.95,48.41 45.97,67.87 46.74,68.63 IRSENSOR.3
SOIL_SCL  (via drill 0.33)
  Top 0.152: v60.96,41.76 60.51,41.3 U3.53 | U6.P$48 64.38,19.45 65.58,20.65 65.58,38.41 64.8,39.19 64.8,40.26 64.82,40.28 v65,40.82 | R26.1 57.66,24.69 58.34,24 58.34,20.42 58.09,20.17 58.09,18.34 57.99,18.24
  Top 0.305: 54.1,18.19 54.1,18.69 53.44,19.36 U6.P$32 48.36,19.36 47.17,18.16 46.63,18.16 46.25,17.78 46.25,15.82 45.85,15.34 41.15,15.34 39.85,13.95 39.85,10.68 U6.P$17 | 54.1,18.19 54.1,11.05 54.59,10.57 55.49,10.57 U6.P$33 | U6.P$48 64.31,19.36 63.2,18.24 57.99,18.24 54.15,18.24 54.1,18.19
  Bottom 0.152: v60.96,41.76 60.98,41.78 61.92,41.78 62.87,40.79 v65,40.82
SOIL_SDA  (via drill 0.33)
  Top 0.152: U3.54 59.29,40.74 60.2,41.66 60.3,42.04 60.76,42.44 61.7,42.42 62.28,41.83 62.28,40.49 62.87,39.9 v63.04,39.9 | U6.P$44 63.16,16.79 66.02,16.79 66.42,17.2 66.42,18.16 67.69,19.43 70.46,19.43 71.78,20.75 v71.78,26.52 71.78,26.85 71.83,39.34 70.23,40.97 66.29,40.97 65.48,40.16 v65.48,39.9 | R25.1 54.97,20.95 v54.13,20.12 | v55.07,15.34 56.18,15.34 56.78,14.74
  Top 0.305: U6.P$21 41.03,14.51 41.4,14.88 46.63,14.88 47.37,15.62 | 47.37,15.62 U6.P$28 | 47.37,15.62 48.51,15.62 53.44,10.69 53.44,10.67 54.61,9.5 56.34,9.5 56.78,9.94 U6.P$37 56.78,14.74 57.61,15.57 61.88,15.57 U6.P$44
  Bottom 0.152: 72.01,26.75 v71.78,26.52 | v65.48,39.9 v63.04,39.9 | v54.13,20.12 54.13,16.28 v55.07,15.34
SS1ADDR0  (via drill 0.33)
  Top 0.152: U3.97 41.35,41.39 41.35,41.96 41.15,42.16 40.23,42.16 39.78,41.71 v39.78,40.46 | U6.P$22 43.57,9.63 43.1,9.17 39.5,9.17 38.73,9.83 38.73,14.61 39.62,15.29 40.46,15.29 v41.3,16.13 | v38.02,21.06 38.02,22.1 38.48,22.55 38.48,26.98 37.77,27.69 37.77,36.25 v37.59,36.42
  Bottom 0.152: v41.3,16.13 41.3,17.75 40.36,18.69 40.36,18.72 v38.02,21.06 | v37.59,36.42 37.59,38.28 v39.78,40.46
SS1ADDR1  (via drill 0.33)
  Top 0.152: U3.96 41.73,41.71 41.73,42.14 41.3,42.57 39.98,42.57 39.24,41.73 39.24,40.92 v38.86,40.51 | v35.23,22.73 35.23,21.39 35.61,21.01 v36.93,21.01 | U6.P$19 44.84,9.79 43.79,8.74 39.19,8.74 38.28,9.53 38.3,14.86 v38.46,15.62
  Bottom 0.152: v38.86,40.51 38.84,40.51 34.47,36.14 34.49,23.47 v35.23,22.73 | v36.93,21.01 39.55,18.39 39.93,18.39 40.79,17.53 40.79,17.32 40.82,17.3 40.82,16.56 40.49,16 40.34,15.88 40.08,15.62 v38.46,15.62
SS1PWR  (via drill 0.33)
  Top 0.152: v40.69,41.34 U3.98 | v37.69,45.11 37.69,45.36 37.25,45.84 36.5,45.84 36.47,45.84 36.47,45.83 R1.2 32.53,45.8 Q3.1
  Bottom 0.152: v40.69,41.34 38.24,41.34 37.69,41.88 v37.69,45.11
SS1SW  (via drill 0.33)
  Top 0.305: Q3.3 28.98,31.47 v29.01,31.45 | v28.96,25.83 28.96,12.72 30.79,10.9 36.91,10.9 37.64,10.16 37.64,9.02 38.71,7.95 47.62,7.95 48.64,8.97 U6.P$24
  Bottom 0.305: v29.01,31.45 29.01,25.88 v28.96,25.83
SS2ADDR0  (via drill 0.33)
  Top 0.152: v32.51,30.15 32.51,43.46 32.74,43.66 40.74,43.66 42.09,42.32 42.54,42.32 U3.94 | U6.P$27 44.84,19.53 44.02,20.34 33.27,20.34 32.77,20.85 v32.77,28.5
  Bottom 0.152: v32.77,28.5 32.77,29.92 32.56,30.1 v32.51,30.15
SS2ADDR1  (via drill 0.33)
  Top 0.152: v31.55,28.47 31.55,19.94 32.28,19.2 37.16,19.2 38.33,18.03 41.78,18.03 43.11,19.36 U6.P$30 | v31.6,30.12 31.6,43.81 32.03,44.25 40.59,44.25 42.04,42.8 42.77,42.8 U3.93
  Bottom 0.152: v31.55,28.47 31.55,30.07 v31.6,30.12
SS2PWR  (via drill 0.33)
  Top 0.152: R22.2 35.77,29.4 v35.79,29.39 | v42.55,38.18 42.55,39.22 43.51,40.18 43.51,40.64 U3.95
  Top 0.305: Q8.1 28.15,29.5 R22.2
  Bottom 0.152: v35.79,29.39 42.55,36.14 v42.55,38.18
SS2SW  (via drill 0.33)
  Top 0.305: v25.04,25.09 25.04,27.3 Q8.3
  Bottom 0.305: U6.P$25 39.52,16.82 36.93,19.41 26.31,19.41 25.07,20.65 25.07,25.07 v25.04,25.09
SS3ADDR0  (via drill 0.33)
  Top 0.152: U3.73 52.52,47.46 50.88,45.82 50.88,45.31 57.23,38.96 v57.71,38.96 | v69.72,29.49 69.72,21.21 68.61,20.09 67.44,20.09 v65.73,18.39 | v65.08,11.46 64.24,11.46 64.01,11.68 60.74,11.68 U6.P$38
  Bottom 0.152: v69.72,29.49 68.96,30.25 62.64,30.25 59.49,33.4 59.49,37.34 57.86,38.96 v57.71,38.96 | v65.73,18.39 65.73,12.12 v65.08,11.46
SS3ADDR1  (via drill 0.33)
  Top 0.152: U3.72 52.08,46.3 51.84,46.3 51.31,45.77 51.31,45.34 57.07,39.57 58.01,39.57 59.21,38.38 v59.59,38.38 | v68.66,31.04 69.01,30.48 69.01,21.34 68.2,20.52 66.85,20.52 65.15,18.82 v65.15,17.4 | v65.15,14.48 66.09,13.54 66.09,11 64.75,9.65 61.29,9.65 60.59,10.35 U6.P$35
  Bottom 0.152: v59.59,38.38 61.16,36.8 61.16,36.27 60.07,35.18 60.07,33.68 62.97,31.04 v68.66,31.04 | v65.15,14.48 v65.15,17.4
SS3PWR  (via drill 0.33)
  Top 0.152: Q9.1 62.09,29.25 v58.9,32.44 | U3.74 50.22,45.85 50.22,45.49 v58.06,37.64
  Top 0.305: Q9.1 63.91,28.96 R23.2
  Bottom 0.152: v58.9,32.44 58.9,36.8 v58.06,37.64
SS3SW  (via drill 0.33)
  Top 0.152: v61.04,24.49 61.04,26.75 Q9.3
  Bottom 0.152: U6.P$40 64.38,17.66 62.99,19.05 62.99,20.14 62.53,20.6 61.7,20.6 61.09,21.21 61.09,24.43 v61.04,24.49
SS4ADDR0  (via drill 0.33)
  Top 0.152: U6.P$43 59.52,17.75 57.66,17.75 57.12,17.35 v56.84,17.35 | v53.49,44.04 52.43,44.93 52.43,45.21 53.59,46.38 U3.70
  Bottom 0.152: v56.84,17.35 54.97,19.23 54.97,27.08 56.59,28.7 56.59,34.95 53.44,38.1 v53.49,44.04
SS4ADDR1  (via drill 0.33)
  Top 0.152: v55.07,43 54.66,43.41 54.66,43.81 53.19,45.29 | 53.19,45.29 53.16,45.29 | U6.P$46 60.62,20.68 61.98,20.68 62.94,21.64 62.94,24.49 65,26.54 v65,38.08 | v66.5,40.26 66.52,40.16 v66.5,38.79 | U3.69 53.19,45.29
  Bottom 0.152: v55.07,43 55.4,42.6 59.23,42.6 59.82,43.18 62.23,43.18 63.73,41.68 65.46,41.68 66.5,40.64 v66.5,40.26 | v65,38.08 65.71,38.79 v66.5,38.79
SS4PWR  (via drill 0.33)
  Top 0.152: R2.2 82.4,45.67 v81.99,45.49 | v52.05,45.67 53.18,46.75 U3.71
  Top 0.305: Q4.1 R2.2
  Bottom 0.152: v52.05,45.67 52.65,45.11 81.28,45.11 81.46,45.29 v81.99,45.49
SS4SW  (via drill 0.33)
  Top 0.152: Q4.3 82.12,11.99 81.2,11.07 66.95,11.07 65.15,9.27 60.27,9.27 59.33,10.21 59.33,10.97 58.01,12.29 58.01,13.89 v57.56,14.35
  Bottom 0.152: v57.56,14.35 57.56,14.77 U6.P$41
SWDCLK  (via drill 0.33)
  Top 0.152: U3.21 45,27.2 41.71,27.2 39.22,29.69 v38.99,29.69 | v37.16,29.69 37.13,32.38 35.18,34.06 35.08,34.16 v33.2,34.16 | v26.19,34.19 24.74,35.64 24.74,39.29 23.29,40.74 SWDCLK.P$1
  Bottom 0.152: v38.99,29.69 v37.16,29.69 | v33.2,34.16 33.27,34.19 v26.19,34.19
SWDIO  (via drill 0.33)
  Top 0.152: SWDIO.P$1 25.25,33.12 v26.14,33.12 | v33.22,33.12 35.53,33.12 36.58,32.21 v36.58,28.19 | v44.48,27.84 46.35,29.72 46.76,29.72 47.6,30.56 U3.20
  Bottom 0.152: v26.14,33.12 v33.22,33.12 | v36.58,28.19 37.62,27.86 v44.48,27.84
USB  (via drill 0.33)
  Top 0.305: U2.P$2 81.2,66.43 81.71,65.91 81.71,64.5 C7.1 81.9,64.31 83.21,64.31 83.44,64.01 v84.02,63.12 | U$1.P1 91.3,32.48 C24.2 91.3,34.05 v90.37,34.98
  Bottom 0.305: v84.02,63.12 84.07,60.98 84.07,59.61 85.09,58.55 89.2,58.55 90.37,57.38 v90.37,34.98
USB_SEL  (via drill 0.33)
  Top 0.152: U2.P$4 82.22,67.67 | 83.13,66.27 83.06,66.37
  Top 0.305: v48.9,49.53 48.9,48.69 U3.76 | R21.2 84.02,66.62 84.02,66.55 83.44,65.96 | 82.22,67.67 82.22,67.18 83.13,66.27 83.44,65.96 | v83.44,65.46 83.44,65.96
  Bottom 0.305: v48.9,49.53 48.84,63.58 49.78,64.34 82.19,64.21 v83.44,65.46
XBEE_DTR  (via drill 0.33)
  Top 0.152: U4.9 24.67,52.89 25.12,53.34 33.86,53.34 v35.46,51.74 | v42.49,52.4 46.08,52.4 46.3,52.17 v46.53,52.17 | U3.44 49.56,43.79 v47.27,43.79
  Bottom 0.152: v35.46,51.74 41.83,51.74 v42.49,52.4 | v46.53,52.17 46.56,44.25 47.02,43.79 v47.27,43.79
XBEE_RX  (via drill 0.33)
  Top 0.152: U4.3 12.67,53.57 12.85,53.75 35,53.75 35.31,53.44 v35.61,53.44 | U3.45 50.42,43.63 50.42,43.64 49.51,44.55 v47.93,44.55 | v44.15,53.47 46.58,53.47 47.12,52.93 v47.12,52.88
  Bottom 0.152: v35.61,53.44 v44.15,53.47 | v47.12,52.88 47.24,45.31 v47.93,44.55
XBEE_TX  (via drill 0.33)
  Top 0.152: U4.2 10.67,54.03 11.02,54.38 v35.64,54.38 | U3.46 49.5,45.26 v48.79,45.26 | v44.15,54.38 47.12,54.38 v47.73,53.77
  Bottom 0.152: v35.64,54.38 v44.15,54.38 | v47.73,53.77 47.78,46 48.51,45.26 v48.79,45.26
XRES  (via drill 0.33)
  Top 0.152: U3.15 44.92,31.37 43.69,31.37 40.21,34.85 v39.19,34.85 | v36.17,34.85 35.48,35.53 v33.22,35.59 | v26.54,35.59 25.63,36.5 25.63,42.04 23.16,44.5 XRES.P$1
  Bottom 0.152: v39.19,34.85 v36.17,34.85 | 33.25,35.59 v33.22,35.59 v26.54,35.59

### Text on the board
bNames: EEC 135 Team Bravo / Final Release Rev 1.0